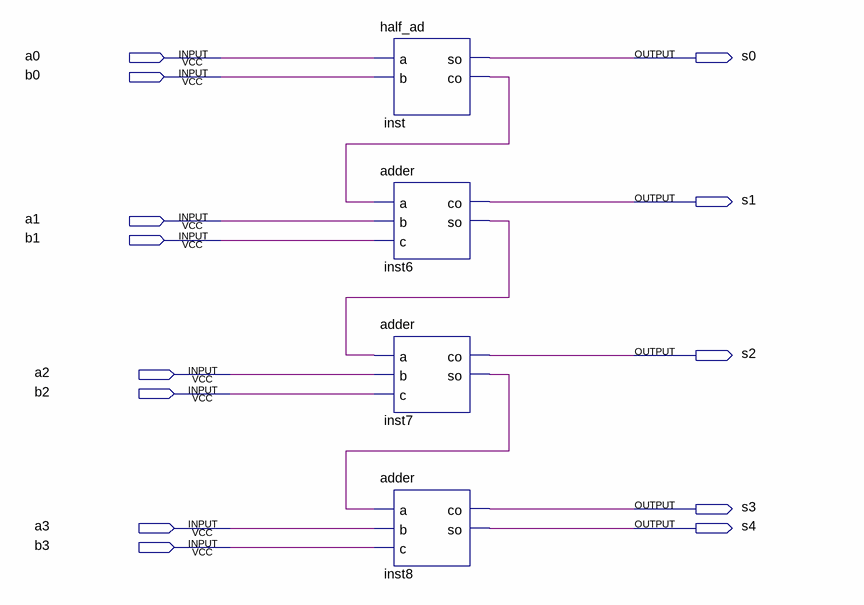
[diagram p0: schematic sheet]
// Quartus schematic Block1.bdf as structural Verilog: 4 symbols, 13 pins
module Block1 (
  input  a0,
  input  b0,
  input  a1,
  input  b1,
  input  a2,
  input  b2,
  input  a3,
  input  b3,
  output s0,
  output s1,
  output s2,
  output s3,
  output s4
);

  wire inst6_so, inst7_so, inst_co;

  half_ad inst (.a(a0), .b(b0), .so(s0), .co(inst_co));
  adder inst6 (.a(inst_co), .b(a1), .c(b1), .co(s1), .so(inst6_so));
  adder inst7 (.a(inst6_so), .b(a2), .c(b2), .co(s2), .so(inst7_so));
  adder inst8 (.a(inst7_so), .b(a3), .c(b3), .co(s3), .so(s4));
endmodule
